# Altium project FINAL_BOARD.PrjPcb
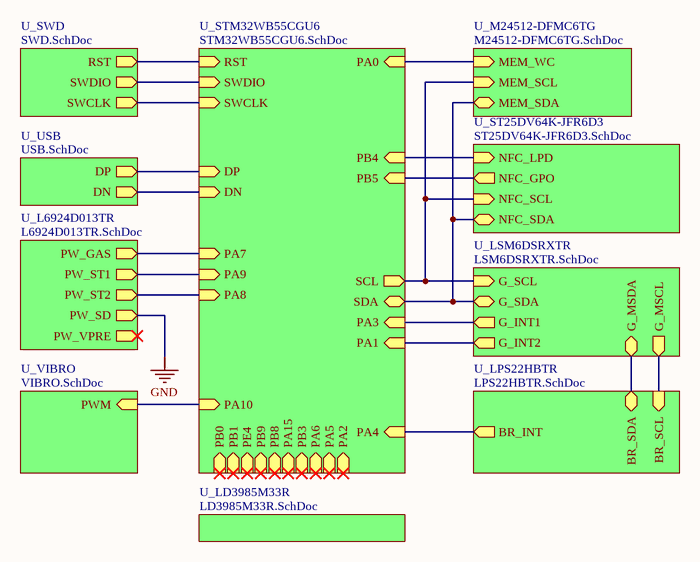
[diagram p0: Device.SchDoc]
8 sheets, 62 parts. Net scope: hierarchical (ports join the sheet entries above them; power ports are global).
Board file: Device.PcbDoc
Sheets:
  Device.SchDoc
    U_STM32WB55CGU6 = STM32WB55CGU6.SchDoc
    U_USB = USB.SchDoc
    U_L6924D013TR = L6924D013TR.SchDoc
    U_M24512-DFMC6TG = M24512-DFMC6TG.SchDoc
    U_ST25DV64K-JFR6D3 = ST25DV64K-JFR6D3.SchDoc
    U_VIBRO = VIBRO.SchDoc
    U_LD3985M33R = LD3985M33R.SchDoc

## Sheet Device.SchDoc
size A4; SheetNumber: 1; SheetTotal: 11

### Sub-sheets
U_L6924D013TR = L6924D013TR.SchDoc: PW_GAS (out), PW_ST1 (out), PW_ST2 (out), PW_SD (out), PW_VPRE (out)
U_LD3985M33R = LD3985M33R.SchDoc: no entries
U_LPS22HBTR = LPS22HBTR.SchDoc (file not in this document): BR_SCL (in), BR_SDA (bidir), BR_INT (out)
U_LSM6DSRXTR = LSM6DSRXTR.SchDoc (file not in this document): G_MSCL (out), G_MSDA (bidir), G_SCL (in), G_SDA (bidir), G_INT1 (out), G_INT2 (out)
U_M24512-DFMC6TG = M24512-DFMC6TG.SchDoc: MEM_SDA (bidir), MEM_SCL (in), MEM_WC (in)
U_ST25DV64K-JFR6D3 = ST25DV64K-JFR6D3.SchDoc: NFC_SCL (in), NFC_SDA (bidir), NFC_GPO (out), NFC_LPD (in)
U_STM32WB55CGU6 = STM32WB55CGU6.SchDoc: SCL (out), SDA (bidir), DP (in), DN (in), RST (in), SWDIO (in), SWCLK (in), PA0 (in), PA1 (in), PA15 (in), PA7 (in), PB4 (in), PB3 (in), PA4 (in), PA5 (in), PA10 (in), PA6 (in), PA2 (in), PA3 (in), PB8 (in), PB9 (in), PB5 (in), PE4 (in), PB1 (in), PB0 (in), PA8 (in), PA9 (in)
U_SWD = SWD.SchDoc (file not in this document): RST (out), SWDIO (out), SWCLK (out)
U_USB = USB.SchDoc: DP (out), DN (out)
U_VIBRO = VIBRO.SchDoc: PWM (in)

### Nets
NetC25_2: sheet U_STM32WB55CGU6/RST, sheet U_SWD/RST
NetD4_1: sheet U_STM32WB55CGU6/DN, sheet U_USB/DN
NetD4_3: sheet U_STM32WB55CGU6/DP, sheet U_USB/DP
NetR2_1: sheet U_STM32WB55CGU6/PA7, sheet U_L6924D013TR/PW_GAS
NetR7_2: sheet U_STM32WB55CGU6/PB5, sheet U_ST25DV64K-JFR6D3/NFC_GPO
NetR12_2: sheet U_STM32WB55CGU6/PA10, sheet U_VIBRO/PWM
NetR15_1: sheet U_STM32WB55CGU6/SCL, sheet U_M24512-DFMC6TG/MEM_SCL, sheet U_ST25DV64K-JFR6D3/NFC_SCL, sheet U_LSM6DSRXTR/G_SCL
NetR16_1: sheet U_STM32WB55CGU6/SDA, sheet U_M24512-DFMC6TG/MEM_SDA, sheet U_ST25DV64K-JFR6D3/NFC_SDA, sheet U_LSM6DSRXTR/G_SDA
NetU2_7: sheet U_STM32WB55CGU6/PA0, sheet U_M24512-DFMC6TG/MEM_WC
NetU3_3: sheet U_STM32WB55CGU6/PA8, sheet U_L6924D013TR/PW_ST2
NetU3_4: sheet U_STM32WB55CGU6/PA9, sheet U_L6924D013TR/PW_ST1
NetU6_1: sheet U_STM32WB55CGU6/PB4, sheet U_ST25DV64K-JFR6D3/NFC_LPD
NetU7_10: sheet U_STM32WB55CGU6/PA1, sheet U_LSM6DSRXTR/G_INT2
NetU7_12: sheet U_STM32WB55CGU6/PA3, sheet U_LSM6DSRXTR/G_INT1
NetU7_13: sheet U_STM32WB55CGU6/PA4, sheet U_LPS22HBTR/BR_INT
NetU7_39: sheet U_STM32WB55CGU6/SWDIO, sheet U_SWD/SWDIO
NetU7_41: sheet U_STM32WB55CGU6/SWCLK, sheet U_SWD/SWCLK
(unnamed): sheet U_LSM6DSRXTR/G_MSCL, sheet U_LPS22HBTR/BR_SCL
(unnamed): sheet U_LSM6DSRXTR/G_MSDA, sheet U_LPS22HBTR/BR_SDA

## Sheet STM32WB55CGU6.SchDoc
size A4; SheetNumber: 7; SheetTotal: 11
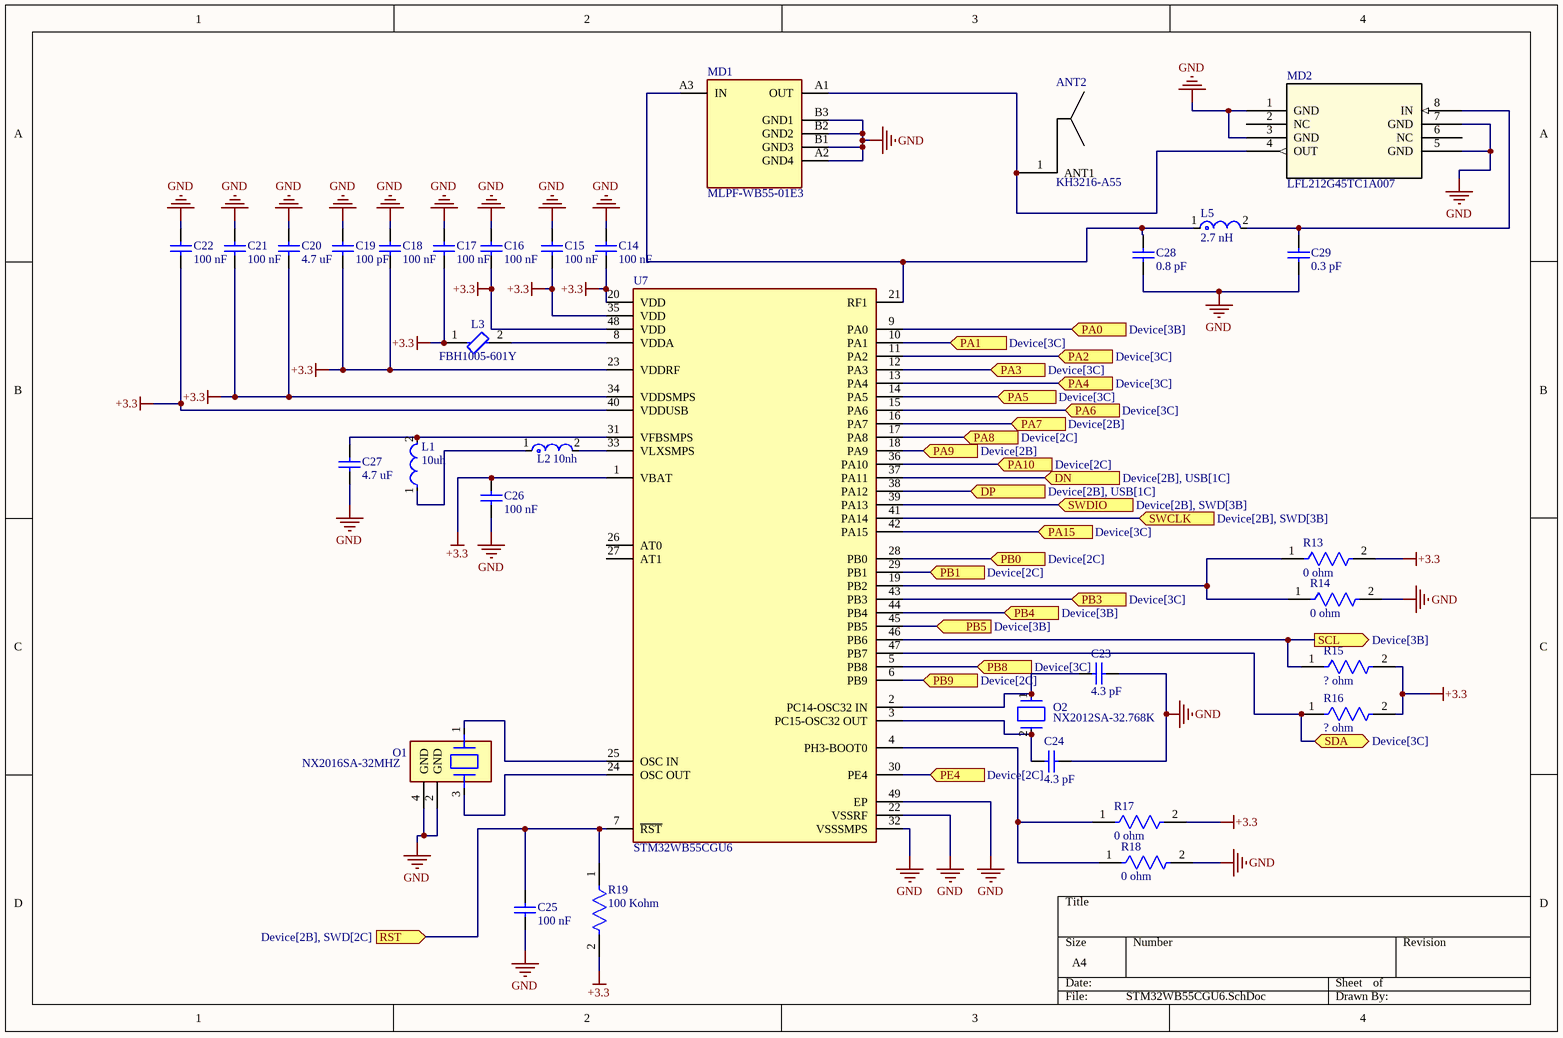
[diagram p1: STM32WB55CGU6.SchDoc]

### Parts
ANT2  KH3216-A55  [KH3216-A55]
C14  100 nF  [CAPC1005X55X25NL05T10]
C15  100 nF  [CAPC1005X55X25NL05T10]
C16  100 nF  [CAPC1005X55X25NL05T10]
C17  100 nF  [CAPC1005X55X25NL05T10]
C18  100 nF  [CAPC1005X55X25NL05T10]
C19  100 pF  [CAPC1005X55X25NL05T10]
C20  4.7 uF  [CAPC1005X55X25NL05T10]
C21  100 nF  [CAPC1005X55X25NL05T10]
C22  100 nF  [CAPC1005X55X25NL05T10]
C23  4.3 pF  [CAPC1005X55X25NL05T10]
C24  4.3 pF  [CAPC1005X55X25NL05T10]
C25  100 nF  [CAPC1005X55X25NL05T10]
C26  100 nF  [CAPC1005X55X25NL05T10]
C27  4.7 uF  [CAPC1005X55X25NL05T10]
C28  0.8 pF  [CAPC1005X55X25NL05T10]
C29  0.3 pF  [CAPC1005X55X25NL05T10]
L1  10uh  [FP-LQM21FN_70-MFG]
L2  10nh  [FP-LQG15WH_02-MFG]
L3  FBH1005-601Y  [FP-BLM15-0_05-MFG]
L5  2.7 nH  [FP-LQG15HH_02-IPC_C]
MD1  MLPF-WB55-01E3  [FP-MLPF-WB55-01E3-MFG]
MD2  LFL212G45TC1A007  [LFL212G45TC1A007]
O1  NX2016SA-32MHZ  [FP-NX2016SA-MFG]
O2  NX2012SA-32.768K  [FP-NX2012SA-MFG]
R13  0 ohm  [FP-RC1005-IPC_C]
R14  0 ohm  [FP-RC1005-IPC_C]
R15  ? ohm  [FP-RC1005-IPC_C]
R16  ? ohm  [FP-RC1005-IPC_C]
R17  0 ohm  [FP-RC1005-IPC_C]
R18  0 ohm  [FP-RC1005-IPC_C]
R19  100 Kohm  [FP-RC1005-IPC_C]
U7  STM32WB55CGU6  [FP-STM32WB55CGU6-MFG]

### Ports
DN (in, see Device[2B], USB[1C]), DP (in, see Device[2B], USB[1C]), PA0 (in, see Device[3B]), PA1 (in, see Device[3C]), PA2 (in, see Device[3C]), PA3 (in, see Device[3C]), PA4 (in, see Device[3C]), PA5 (in, see Device[3C]), PA6 (in, see Device[3C]), PA7 (in, see Device[2B]), PA8 (in, see Device[2C]), PA9 (in, see Device[2B]), PA10 (in, see Device[2C]), PA15 (in, see Device[3C]), PB0 (in, see Device[2C]), PB1 (in, see Device[2C]), PB3 (in, see Device[3C]), PB4 (in, see Device[3B]), PB5 (in, see Device[3B]), PB8 (in, see Device[3C]), PB9 (in, see Device[2C]), PE4 (in, see Device[2C]), RST (in, see Device[2B], SWD[2C]), SCL (out, see Device[3B]), SDA (bidir, see Device[3C]), SWCLK (in, see Device[2B], SWD[3B]), SWDIO (in, see Device[2B], SWD[3B])

### Nets
+3.3: C14.1 C15.2 C16.1 C17.2 C18.1 C19.2 C20.2 C21.1 C22.2 C26.2 L3.1 R13.2 R15.2 R16.2 R17.2 R19.2 U7.1(VBAT) U7.20(VDD) U7.23(VDDRF) U7.34(VDDSMPS) U7.35(VDD) U7.40(VDDUSB) U7.48(VDD)
GND: C14.2 C15.1 C16.2 C17.1 C18.2 C19.1 C20.1 C21.2 C22.1 C23.2 C24.1 C25.1 C26.1 C27.2 C28.2 C29.2 MD1.A2(GND4) MD1.B1(GND3) MD1.B2(GND2) MD1.B3(GND1) MD2.1(GND) MD2.3(GND) MD2.5(GND) MD2.7(GND) O1.2(GND) O1.4(GND) R14.2 R18.2 U7.22(VSSRF) U7.32(VSSSMPS) U7.49(EP)
NetANT2_1: ANT2.1(ANT1) MD1.A1(OUT) MD2.4(OUT)
NetC23_1: C23.1 O2.1 U7.2(PC14-OSC32_IN)
NetC24_2: C24.2 O2.2 U7.3(PC15-OSC32_OUT)
NetC25_2: C25.2 R19.1 U7.7(~{RST}) ; port RST
NetC27_1: C27.1 L1.2 U7.31(VFBSMPS)
NetC28_1: C28.1 L5.1 MD1.A3(IN) U7.21(RF1)
NetC29_1: C29.1 L5.2 MD2.8(IN)
NetD4_1: U7.37(PA11) ; port DN
NetD4_3: U7.38(PA12) ; port DP
NetL1_1: L1.1 L2.1
NetL2_2: L2.2 U7.33(VLXSMPS)
NetL3_2: L3.2 U7.8(VDDA)
NetO1_1: O1.1 U7.25(OSC_IN)
NetO1_3: O1.3 U7.24(OSC_OUT)
NetR2_1: U7.16(PA7) ; port PA7
NetR7_2: U7.45(PB5) ; port PB5
NetR12_2: U7.36(PA10) ; port PA10
NetR13_1: R13.1 R14.1 U7.19(PB2)
NetR15_1: R15.1 U7.46(PB6) ; port SCL
NetR16_1: R16.1 U7.47(PB7) ; port SDA
NetR17_1: R17.1 R18.1 U7.4(PH3-BOOT0)
NetU2_7: U7.9(PA0) ; port PA0
NetU3_3: U7.17(PA8) ; port PA8
NetU3_4: U7.18(PA9) ; port PA9
NetU6_1: U7.44(PB4) ; port PB4
NetU7_5: U7.5(PB8) ; port PB8
NetU7_6: U7.6(PB9) ; port PB9
NetU7_10: U7.10(PA1) ; port PA1
NetU7_11: U7.11(PA2) ; port PA2
NetU7_12: U7.12(PA3) ; port PA3
NetU7_13: U7.13(PA4) ; port PA4
NetU7_14: U7.14(PA5) ; port PA5
NetU7_15: U7.15(PA6) ; port PA6
NetU7_28: U7.28(PB0) ; port PB0
NetU7_29: U7.29(PB1) ; port PB1
NetU7_30: U7.30(PE4) ; port PE4
NetU7_39: U7.39(PA13) ; port SWDIO
NetU7_41: U7.41(PA14) ; port SWCLK
NetU7_42: U7.42(PA15) ; port PA15
NetU7_43: U7.43(PB3) ; port PB3

Not connected (* = marked no-connect by the designer): MD2 2(NC) 6(NC); U7 26(AT0) 27(AT1)

### Library data of the parts
C14-C29 = CMP-2008-04515-1: Manufacturer: Murata; Part Number: GRM155F50J684ZE01D
L1 = CMP-2000-06587-2: FIXED IND 10UH 100MA 780MOHM SMD; Shielding: Shielded; Core Material: Ferrite; Self Resonant Frequency: 15MHz; Tolerance: 20%; DC Resistance (DCR): 780mR; Test Frequency: 1MHz; Height: 1.45mm; Package Quantity: 3000; Width: 0.049inch; Inductance: 10uH; Saturation Current: 100mA; Termination: SMD/SMT; Case Code (Metric): 2012; Case/Package: 0805; RoHS Compliant: Yes; Series: LQM21F_70; Max Operating Temperature: 125°C; Lead Free: Lead Free; DC Current: 100mA; Length: 2.2mm; Radiation Hardening: No; Max DC Current: 100mA; Case Code (Imperial): 0805; Packaging: Tape and Reel; Height - Seated (Max): 0.057inch; Rated Current-Max: 100mA; Military Standard: Not; Mount: Surface Mount; Min Operating Temperature: -55°C; Depth: 1.45mm; Current Rating: 100mA
L2 = CMP-06042-005237-1: Multilayer type Inductor for Automotive 10nH ±5% 0.19Ω 500mA 0402; Core Material: Air; Test Frequency: 100MHz; DC Resistance (DCR): 190mR; Shielding: Unshielded; Self Resonant Frequency: 3.3GHz; Min Operating Temperature: -55°C; Tolerance: 5%; Inductance: 10nH; Max Operating Temperature: 125°C; Packaging: Cut Tape; Current Rating: 500mA; Case Code (Metric): 1005; Mount: Surface Mount; Case/Package: 0402; Ratings: AEC-Q200; Case Code (Imperial): 0402
L3 = CMP-0686-00187-4: Chip Ferrite Bead, 0402, 600Ω @ 100MHz, 0.52Ω, 25%, 300mA; DC Resistance-Max: 600mR; Number of Lines: 1; DC Resistance (DCR): 520mR; Shielding: Unshielded; Impedance: 600R; Material: Steel; Frequency: 100MHz; Lead Free: Lead Free; Max DC Current: 300mA; Test Frequency: 100MHz; Depth: 0.55mm; Length: 1mm; Case Code (Imperial): 0402; Packaging: Tape and Reel; Height: 0.5mm; Max Operating Temperature: 125°C; Military Standard: Not; REACH SVHC: No SVHC; Case Code (Metric): 1005; Series: BLM15AG_SN; Core Material: Ferrite; Termination: SMD/SMT; DC Current: 300mA; Package Quantity: 10000; Width: 0.5mm; RoHS Compliant: Yes; Min Operating Temperature: -55°C; Current Rating: 300mA; Case/Package: 0402; Number of Pins: 2; Radiation Hardening: No; Tolerance: 25%; Number of Circuits: 1; Max Current Rating: 300mA
L5 = CMP-2000-06580-2: Multilayer type RF Inductor 2.7nH ±0.3nH 0.12Ω 800mA 0402; Max DC Current: 300mA; Q Factor: 8; Core Material: Air; Test Frequency: 100MHz; Shielding: Unshielded; Self Resonant Frequency: 6GHz; DC Resistance (DCR): 150mR; Packaging: Tape and Reel; Depth: 0.55mm; DC Current: 300mA; Length: 1mm; Current Rating: 300mA; Lead Free: Lead Free; Max Operating Temperature: 125°C; Mount: Surface Mount; Height - Seated (Max): 0.022inch; Case Code (Imperial): 0402; Height: 0.5mm; Termination: SMD/SMT; Package Quantity: 10000; Radiation Hardening: No; Width: 0.5mm; Case Code (Metric): 1005; Min Operating Temperature: -55°C; Military Standard: Not; Case/Package: 0402; Inductance: 2.7nH
MD1 = CMP-12074-000002-1: RF FILTER LOW PASS 2.45GHZ 6SMD
O1 = CMP-200220-000017-1: CRYSTAL 32.0000MHZ 8PF SMD; Frequency: 32MHz; ESR (Equivalent Series Resistance): 60R; Ratings: AEC-Q200; Mount: Surface Mount; Case/Package: SMD/SMT; Packaging: Tape and Reel; Load Capacitance: 8pF; Min Operating Temperature: -40°C; Max Operating Temperature: 125°C
O2 = CMP-200220-000019-1: CRYSTAL 32.7680KHZ 12.5PF SMD; Frequency Tolerance: 20ppm; ESR (Equivalent Series Resistance): 80kR; Frequency: 32.768kHz; Mount: Surface Mount; Packaging: Cut Tape; Min Operating Temperature: -40°C; Max Operating Temperature: 85°C; Case/Package: SMD/SMT; RoHS Compliant: Yes; Length: 0.081inch; Series: NX2012SA; Height: 0.024inch; Width: 0.047inch; Load Capacitance: 12.5pF
R13-R19 = CMP-13261-000953-1: Res Thick Film 0402 1.87kΩ 1% 0.063W ±100ppm/°C Molded SMD T/R; Power Rating: 63mW; Voltage Rating (DC): 50V; Resistance: 1.87kR; Tolerance: 1%; Height: 0.016inch; Length: 1mm; Case Code (Metric): 1005; Width: 0.02inch; Max Power Dissipation: 63mW; Radiation Hardening: No; Features: Moisture Resistant; Temperature Coefficient: 100ppm/°C; Min Operating Temperature: -55°C; Number of Terminations: 2; Max Operating Temperature: 155°C; Case Code (Imperial): 0402; Composition: Thick Film; Depth: 0.5mm; Lead Free: Lead Free; Package Quantity: 1; Case/Package: 0402; Packaging: Tape and Reel; Contact Plating: Tin; Military Standard: Not
U7 = CMP-12105-000013-1: ULTRA-LOW-POWER DUAL CORE ARM CO; Manufacturer: STMicroelectronics; Number Of Cores: 1; Number Of I2C Channels: 2; Interface: I2C,SPI,UART,USART,2-Wire,USB,IrDA,Other; Core Architecture: ARM Cortex-M4; Data Bus Width: 32bits; Memory Size: 1MBytes; Number Of Pwm Channels: 14; Max Supply Voltage: 3.6V; Standoff Height: 0mm; Number Of Timers/Counters: 6; Frequency: 64MHz; Max Junction Temp: +105°C; Number Of I/Os: 30; Min Supply Voltage: 1.71V; Number Of Adc Channels: 13; Ram Size: 256KBytes; Memory Type: FLASH; Octopart: https://octopart.com/stm32wb55cgu6-stmicroelectronics-98750847; Temperature Range High: +105°C; RoHS: TRUE; Number Of Spi Channels: 1; Category: IC; Device Class L1: Integrated Circuits (ICs); Lead Free: Yes; Height: 0.65mm; Number Of A/D Converters: 1; Package: UFQFPN48; Number Of Usb Channels: 1; Number Of Uart Channels: 2; Temperature Range Low: -40°C; Ambient Temperature Range Low: -40°C; Device Class L3: Microcontrollers; Manufacturer Part Number: STM32WB55CGU6; Temperature: -40°C to +105°C; ComponentLink2URL: https://www.st.com/resource/en/datasheet/stm32wb55cg.pdf; Device Class L2: Embedded Processors and Controllers; Digikey Description: ULTRA-LOW-POWER DUAL CORE ARM CO; ComponentLink2Description: Datasheet; Ambient Temperature Range High: +85°C; Automotive: No

## Sheet USB.SchDoc
size A4; SheetNumber: 10; SheetTotal: 11
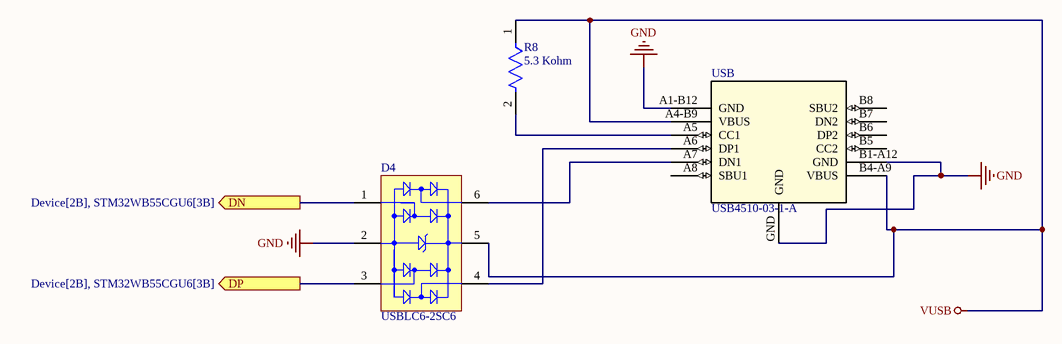
[diagram p2: USB.SchDoc]

### Parts
D4  USBLC6-2SC6  [STM-SOT23-6L_V]
R8  5.3 Kohm  [FP-RC1005-IPC_C]
USB  USB4510-03-1-A  [USB4510-03-1-A]

### Ports
DN (out, see Device[2B], STM32WB55CGU6[3B]), DP (out, see Device[2B], STM32WB55CGU6[3B])

### Nets
GND: D4.2(GND) USB.A1-B12(GND) USB.B1-A12(GND) USB.GND
VUSB: D4.5(VBUS) R8.1 USB.A4-B9(VBUS) USB.B4-A9(VBUS)
NetD4_1: D4.1(I/O_1) ; port DN
NetD4_3: D4.3(I/O_2) ; port DP
NetD4_4: D4.4(I/O_3) USB.A6(DP1)
NetD4_6: D4.6(I/O_4) USB.A7(DN1)
NetR8_2: R8.2 USB.A5(CC1)

Not connected (* = marked no-connect by the designer): USB A8(SBU1) B5(CC2) B6(DP2) B7(DN2) B8(SBU2)

### Library data of the parts
D4 = CMP-2000-05378-1: Very low capacitance ESD protection, 3.5 pF, -40 to 125 degC, 6-Pin SOT23, RoHS, Tape and Reel; Manufacturer: STMicroelectronics; Polarity: Uni-Directional; Clamping Voltage: 17V; Rad Hardened: No; Product Height (mm): 1.3mm; Leakage Current (Max): 0.15uA; Product Length (mm): 3.05mm; Number of Elements: 1; Peak Pulse Current: 5A; Configuration: Dual; Reverse Breakdown Voltage: 6V; Working Voltage (Max): 5V; Capacitance Value: 3.5pF; Suppressor Type: DiodeArrays; Product Depth (mm): 1.75mm; Test Current (It): 1mA; Package / Case: SOT-23; Operating Temperature Max Deg. C: 125C; Package Description: 6-Pin Small Outline Transistor, Body 2.925 x 1.625 mm, Pitch 0.95 mm; Package Reference: SOT23-6L; Datasheet Version: Rev. 5, 10/2011; Operating Temperature Min Deg. C: -40C; Mounting Style: SurfaceMount; Direction Type: Uni-Directional; Mounting: SurfaceMount; Pin Count: 6; Leakage Current: 0.15uA; Packaging: TapeandReel; Operating Temperature Classification: Automotive; Clamping Voltage (Max): 17V; Manufacturer URL: http://www.st.com/; Reverse Stand-off Voltage: 5V; Datasheet URL: http://www.st.com/st-web-ui/static/active/en/resource/technical/document/datasheet/CD00050750.pdf; Working Voltage: 5V; Operating Temp Range: -40Cto125C
R8 = CMP-13261-000953-1: as R13 on sheet STM32WB55CGU6; Tolerance: 1%; Height: 0.016inch; Length: 1mm; Case Code (Metric): 1005; Width: 0.02inch; Max Power Dissipation: 63mW; Radiation Hardening: No; Features: Moisture Resistant; Temperature Coefficient: 100ppm/°C; Min Operating Temperature: -55°C; Number of Terminations: 2; Max Operating Temperature: 155°C; Case Code (Imperial): 0402; Composition: Thick Film; Depth: 0.5mm; Lead Free: Lead Free; Package Quantity: 1; Case/Package: 0402; Packaging: Tape and Reel; Contact Plating: Tin; Military Standard: Not

## Sheet L6924D013TR.SchDoc
size A4; SheetNumber: 2; SheetTotal: 11
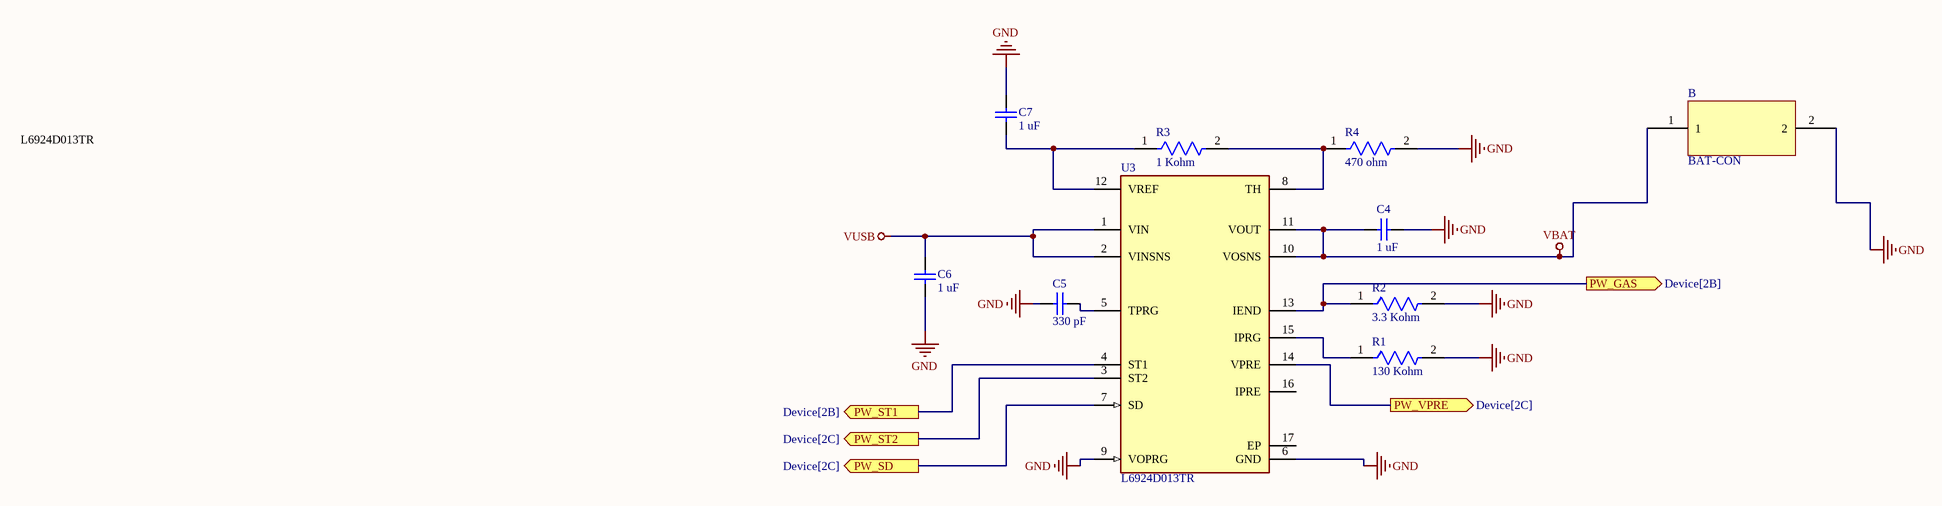
[diagram p3: L6924D013TR.SchDoc]

### Parts
B  BAT-CON  [BAT-CON]
C4  1 uF  [CAPC1005X55X25NL05T10]
C5  330 pF  [CAPC1005X55X25NL05T10]
C6  1 uF  [CAPC1005X55X25NL05T10]
C7  1 uF  [CAPC1005X55X25NL05T10]
R1  130 Kohm  [FP-RC1005-IPC_C]
R2  3.3 Kohm  [FP-RC1005-IPC_C]
R3  1 Kohm  [FP-RC1005-IPC_C]
R4  470 ohm  [FP-RC1005-IPC_C]
U3  L6924D013TR  [FP-VFQFPN16-7185330-MFG]

### Ports
PW_GAS (out, see Device[2B]), PW_SD (out, see Device[2C]), PW_ST1 (out, see Device[2B]), PW_ST2 (out, see Device[2C]), PW_VPRE (out, see Device[2C])

### Nets
GND: B.2 C4.1 C5.2 C6.2 C7.1 R1.2 R2.2 R4.2 U3.6(GND) U3.7(SD) U3.9(VOPRG) ; port PW_SD
VBAT: B.1 C4.2 U3.10(VOSNS) U3.11(VOUT)
VUSB: C6.1 U3.1(VIN) U3.2(VINSNS)
NetC5_1: C5.1 U3.5(TPRG)
NetC7_2: C7.2 R3.1 U3.12(VREF)
NetR1_1: R1.1 U3.15(IPRG)
NetR2_1: R2.1 U3.13(IEND) ; port PW_GAS
NetR3_2: R3.2 R4.1 U3.8(TH)
NetU3_3: U3.3(ST2) ; port PW_ST2
NetU3_4: U3.4(ST1) ; port PW_ST1
NetU3_14: U3.14(VPRE) ; port PW_VPRE

Not connected (* = marked no-connect by the designer): U3 16(IPRE) 17(EP)

### Notes on the sheet
- L6924D013TR

### Library data of the parts
C4-C7 = CMP-2008-04515-1: as C14 on sheet STM32WB55CGU6
R1-R4 = CMP-13261-000953-1: as R13 on sheet STM32WB55CGU6; Tolerance: 1%; Height: 0.016inch; Length: 1mm; Case Code (Metric): 1005; Width: 0.02inch; Max Power Dissipation: 63mW; Radiation Hardening: No; Features: Moisture Resistant; Temperature Coefficient: 100ppm/°C; Min Operating Temperature: -55°C; Number of Terminations: 2; Max Operating Temperature: 155°C; Case Code (Imperial): 0402; Composition: Thick Film; Depth: 0.5mm; Lead Free: Lead Free; Package Quantity: 1; Case/Package: 0402; Packaging: Tape and Reel; Contact Plating: Tin; Military Standard: Not
U3 = CMP-12147-000005-1: IC BATT CHRGR ION/POLY 16-VFQFPN; Manufacturer: STMicroelectronics; Output Current: 975mA; Number Of Cells: 1; Standoff Height: 0.02mm; Max Junction Temp: +125°C; Max Supply Voltage: 12V; Nominal Supply Current: 1.8mA; Max Power Dissipation: 0.67W; Min Supply Voltage: 2.5V; Output Voltage: 4.2V; Automotive: No; Manufacturer Part Number: L6924D013TR; Digikey Description: IC BATT CHRGR ION/POLY 16-VFQFPN; ComponentLink2Description: Datasheet; Footprint Url: https://www.st.com/resource/en/datasheet/l6738.pdf; Device Class L2: Power Management ICs; Package: VFQFPN16-7185330; Temperature Range High: +125°C; Mouser Description: Battery Management Battery Charger Sys Li-Ion/Li-Poly; Number Of Outputs: 1; Lead Free: Yes; Device Class L3: Battery Management; Category: IC; Temperature: -40°C to +125°C; Temperature Range Low: -40°C; Octopart: https://octopart.com/l6924d013tr-stmicroelectronics-421996; ComponentLink2URL: https://www.st.com/resource/en/datasheet/l6924d.pdf; Device Class L1: Integrated Circuits (ICs); Height: 1mm; Ipc Land Pattern Name: QFN50P300X300X90-16; RoHS: TRUE

## Sheet M24512-DFMC6TG.SchDoc
size A4; SheetNumber: 6; SheetTotal: 11
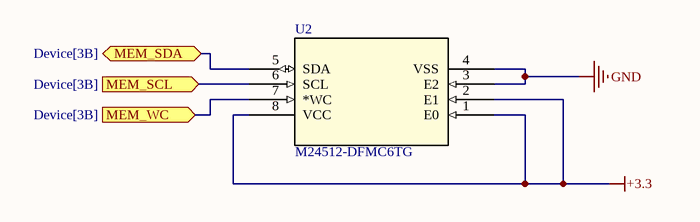
[diagram p4: M24512-DFMC6TG.SchDoc]

### Parts
U2  M24512-DFMC6TG  [M24512-DFMC6TG]

### Ports
MEM_SCL (in, see Device[3B]), MEM_SDA (bidir, see Device[3B]), MEM_WC (in, see Device[3B])

### Nets
+3.3: U2.1(E0) U2.2(E1) U2.8(VCC)
GND: U2.3(E2) U2.4(VSS)
NetR15_1: U2.6(SCL) ; port MEM_SCL
NetR16_1: U2.5(SDA) ; port MEM_SDA
NetU2_7: U2.7(*WC) ; port MEM_WC

## Sheet ST25DV64K-JFR6D3.SchDoc
size A4; SheetNumber: 8; SheetTotal: 11
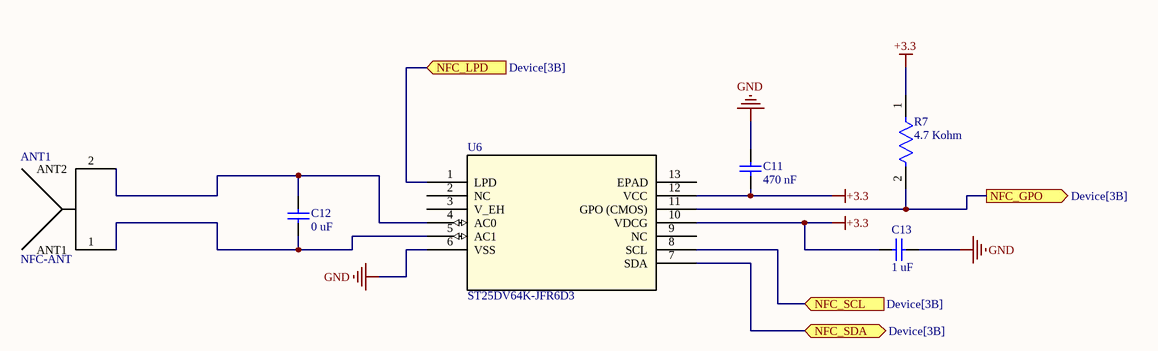
[diagram p5: ST25DV64K-JFR6D3.SchDoc]

### Parts
ANT1  NFC-ANT  [NFC-ANT]
C11  470 nF  [CAPC1005X55X25NL05T10]
C12  0 uF  [CAPC1005X55X25NL05T10]
C13  1 uF  [CAPC1005X55X25NL05T10]
R7  4.7 Kohm  [FP-RC1005-IPC_C]
U6  ST25DV64K-JFR6D3  [ST25DV64K-JFR6D3]

### Ports
NFC_GPO (out, see Device[3B]), NFC_LPD (in, see Device[3B]), NFC_SCL (in, see Device[3B]), NFC_SDA (bidir, see Device[3B])

### Nets
+3.3: C11.2 C13.1 R7.1 U6.10(VDCG) U6.12(VCC)
GND: C11.1 C13.2 U6.6(VSS)
NetANT1_1: ANT1.1(ANT1) C12.2 U6.5(AC1)
NetANT1_2: ANT1.2(ANT2) C12.1 U6.4(AC0)
NetR7_2: R7.2 U6.11(GPO_(CMOS)) ; port NFC_GPO
NetR15_1: U6.8(SCL) ; port NFC_SCL
NetR16_1: U6.7(SDA) ; port NFC_SDA
NetU6_1: U6.1(LPD) ; port NFC_LPD

Not connected (* = marked no-connect by the designer): U6 2(NC) 3(V_EH) 9(NC) 13(EPAD)

### Library data of the parts
C11-C13 = CMP-2008-04515-1: as C14 on sheet STM32WB55CGU6
R7 = CMP-13261-000953-1: as R13 on sheet STM32WB55CGU6; Tolerance: 1%; Height: 0.016inch; Length: 1mm; Case Code (Metric): 1005; Width: 0.02inch; Max Power Dissipation: 63mW; Radiation Hardening: No; Features: Moisture Resistant; Temperature Coefficient: 100ppm/°C; Min Operating Temperature: -55°C; Number of Terminations: 2; Max Operating Temperature: 155°C; Case Code (Imperial): 0402; Composition: Thick Film; Depth: 0.5mm; Lead Free: Lead Free; Package Quantity: 1; Case/Package: 0402; Packaging: Tape and Reel; Contact Plating: Tin; Military Standard: Not

## Sheet VIBRO.SchDoc
size A4; SheetNumber: 11; SheetTotal: 11
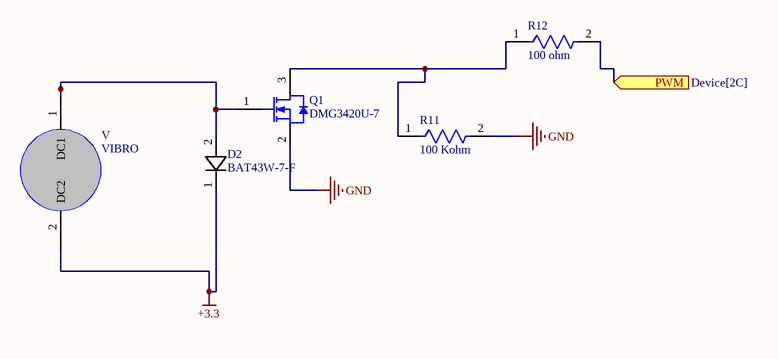
[diagram p6: VIBRO.SchDoc]

### Parts
D2  BAT43W-7-F  [BAT43W-7-F]
Q1  DMG3420U-7  [DIOD-SOT23-3_B_V]
R11  100 Kohm  [FP-RC1005-IPC_C]
R12  100 ohm  [FP-RC1005-IPC_C]
V  VIBRO  [VIBRO]

### Ports
PWM (in, see Device[2C])

### Nets
+3.3: D2.1 V.2(DC2)
GND: Q1.2(S) R11.2
NetD2_2: D2.2 Q1.1(G) V.1(DC1)
NetQ1_3: Q1.3(D) R11.1 R12.1
NetR12_2: R12.2 ; port PWM

### Library data of the parts
Q1 = CMP-2000-06172-1: N-Channel Enhancement Mode MOSFET, 20 V, -55 to 150 degC, 3-Pin SOT23, RoHS, Tape and Reel; Manufacturer: Diodes Inc; Drain-Source On Resistance-Max: 29mO; Qg Gate Charge: 5.4nC; Drain-to-Source Voltage [Vdss]: 20V; Rated Power Dissipation: 740mW; Datasheet URL: http://www.diodes.com/_files/datasheets/ds31867.pdf; Package Description: 3-Pin Small Outline Transistor, Body 2.9 x 1.3 mm, Pitch 0.96 mm; Package Reference: SOT23-3; Datasheet Version: Rev. 5-2, 09/2013; Mounting Technology: SurfaceMount; Channel Type: N-Channel; Manufacturer URL: http://www.diodes.com/
R11 R12 = CMP-13261-000953-1: as R13 on sheet STM32WB55CGU6; Tolerance: 1%; Height: 0.016inch; Length: 1mm; Case Code (Metric): 1005; Width: 0.02inch; Max Power Dissipation: 63mW; Radiation Hardening: No; Features: Moisture Resistant; Temperature Coefficient: 100ppm/°C; Min Operating Temperature: -55°C; Number of Terminations: 2; Max Operating Temperature: 155°C; Case Code (Imperial): 0402; Composition: Thick Film; Depth: 0.5mm; Lead Free: Lead Free; Package Quantity: 1; Case/Package: 0402; Packaging: Tape and Reel; Contact Plating: Tin; Military Standard: Not

## Sheet LD3985M33R.SchDoc
size A4; SheetNumber: 3; SheetTotal: 11
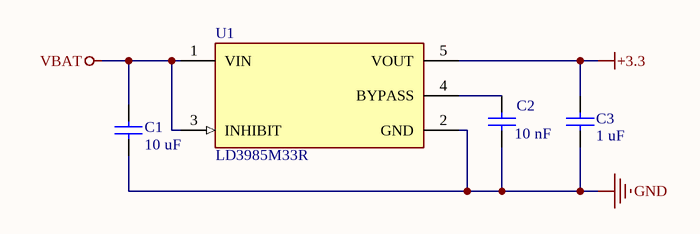
[diagram p7: LD3985M33R.SchDoc]

### Parts
C1  10 uF  [CAPC1005X55X25NL05T10]
C2  10 nF  [CAPC1005X55X25NL05T10]
C3  1 uF  [CAPC1005X55X25NL05T10]
U1  LD3985M33R  [FP-SOT23-5L-7049676-MFG]

### Nets
+3.3: C3.2 U1.5(VOUT)
GND: C1.1 C2.1 C3.1 U1.2(GND)
VBAT: C1.2 U1.1(VIN) U1.3(INHIBIT)
NetC2_2: C2.2 U1.4(BYPASS)

### Library data of the parts
C1-C3 = CMP-2008-04515-1: as C14 on sheet STM32WB55CGU6
U1 = CMP-0244-00328-2: IC REG LINEAR 3.3V 150MA SOT23-5; Input Bias Current: 85uA; Output Type: Fixed; Max Input Voltage: 6V; Min Input Voltage: 2.5V; Output Voltage Accuracy: 2%; Quiescent Current: 150uA; Number of Regulators: 1; Min Current Limit: 300mA; Dropout Voltage: 60mV; Polarity: Positive; Min Operating Temperature: -40°C; Height: 1.3mm; Radiation Hardening: No; Package Quantity: 1; Number of Pins: 5; Output Current: 150mA; Width: 1.75mm; Length: 3mm; Mount: Surface Mount; Case/Package: SOT-23; Lead Free: Lead Free; Number of Outputs: 1; Max Operating Temperature: 125°C; Accuracy: 2%; Max Output Current: 150mA; Packaging: Tape and Reel; Output Voltage: 3.3V; Min Output Voltage: 3.3V

## Nets that join several sheets
+3.3: STM32WB55CGU6 (23 pins), M24512-DFMC6TG (U2.1 U2.2 U2.8), ST25DV64K-JFR6D3 (5 pins), VIBRO (D2.1 V.2), LD3985M33R (C3.2 U1.5)
GND: STM32WB55CGU6 (31 pins), USB (D4.2 USB.A1-B12 USB.B1-A12 USB.GND), L6924D013TR (11 pins), M24512-DFMC6TG (U2.3 U2.4), ST25DV64K-JFR6D3 (C11.1 C13.2 U6.6), VIBRO (Q1.2 R11.2), LD3985M33R (C1.1 C2.1 C3.1 U1.2)
VBAT: L6924D013TR (B.1 C4.2 U3.10 U3.11), LD3985M33R (C1.2 U1.1 U1.3)
VUSB: USB (D4.5 R8.1 USB.A4-B9 USB.B4-A9), L6924D013TR (C6.1 U3.1 U3.2)
NetD4_1: STM32WB55CGU6 (U7.37), USB (D4.1)
NetD4_3: STM32WB55CGU6 (U7.38), USB (D4.3)
NetR2_1: STM32WB55CGU6 (U7.16), L6924D013TR (R2.1 U3.13)
NetR7_2: STM32WB55CGU6 (U7.45), ST25DV64K-JFR6D3 (R7.2 U6.11)
NetR12_2: STM32WB55CGU6 (U7.36), VIBRO (R12.2)
NetR15_1: STM32WB55CGU6 (R15.1 U7.46), M24512-DFMC6TG (U2.6), ST25DV64K-JFR6D3 (U6.8)
NetR16_1: STM32WB55CGU6 (R16.1 U7.47), M24512-DFMC6TG (U2.5), ST25DV64K-JFR6D3 (U6.7)
NetU2_7: STM32WB55CGU6 (U7.9), M24512-DFMC6TG (U2.7)
NetU3_3: STM32WB55CGU6 (U7.17), L6924D013TR (U3.3)
NetU3_4: STM32WB55CGU6 (U7.18), L6924D013TR (U3.4)
NetU6_1: STM32WB55CGU6 (U7.44), ST25DV64K-JFR6D3 (U6.1)